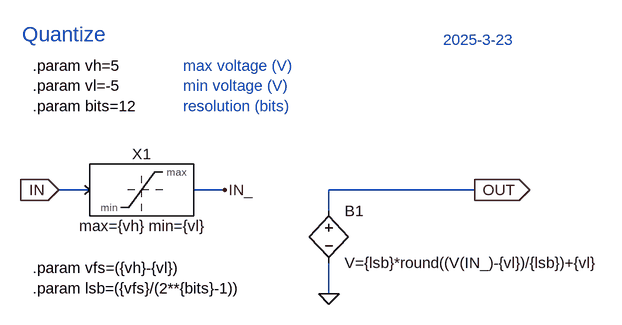
[diagram p0: schematic QUANTIZE.asc]
QUANTIZE.asc, the LTspice schematic file:
Version 4
SHEET 1 880 680
WIRE -160 -416 -208 -416
WIRE 48 -416 0 -416
WIRE 432 -416 208 -416
WIRE 208 -384 208 -416
WIRE 208 -256 208 -304
FLAG -208 -416 IN
IOPIN -208 -416 In
FLAG 432 -416 OUT
IOPIN 432 -416 Out
FLAG 208 -256 0
FLAG 48 -416 IN_
SYMBOL bv 208 -400 R0
SYMATTR InstName B1
SYMATTR Value V={lsb}*round((V(IN_)-{vl})/{lsb})+{vl}
SYMBOL PowerSim\\LIMIT -80 -416 R0
WINDOW 39 2 71 Bottom 2
SYMATTR SpiceLine max={vh} min={vl}
SYMATTR InstName X1
TEXT -264 -656 Left 3 ;Quantize
TEXT 384 -648 Left 2 ;2025-3-23
TEXT -248 -608 Left 2 !.param vh=5\n.param vl=-5\n.param bits=12
TEXT -248 -296 Left 2 !.param vfs=({vh}-{vl})\n.param lsb=({vfs}/(2**{bits}-1))
TEXT -16 -608 Left 2 ;max voltage (V)\nmin voltage (V)\nresolution (bits)

The netlist it stands for:
* QUANTIZE.asc
B1 OUT 0 V={lsb}*round((V(IN_)-{vl})/{lsb})+{vl}
XX1 IN IN_ LIMIT max={vh} min={vl}  ; pins in out
* Quantize
* 2025-3-23
.param vh=5
.param vl=-5
.param bits=12
.param vfs=({vh}-{vl})
.param lsb=({vfs}/(2**{bits}-1))
* max voltage (V)
* min voltage (V)
* resolution (bits)
.backanno
.end